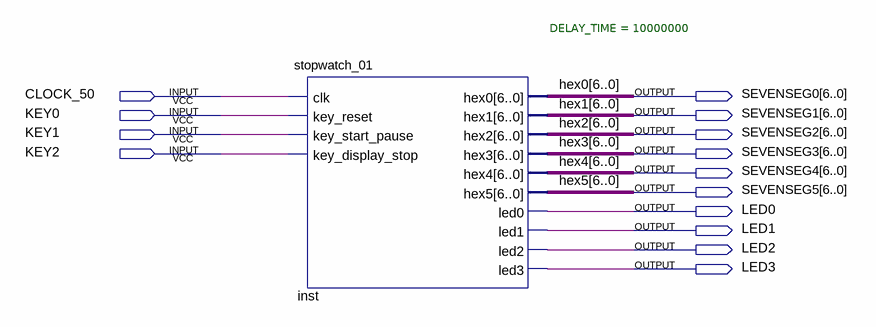
[diagram p0: schematic sheet]
// Quartus schematic stopwatch.bdf as structural Verilog: 1 symbols, 14 pins
module stopwatch (
  input  CLOCK_50,
  input  KEY0,
  input  KEY1,
  input  KEY2,
  output [6:0] SEVENSEG0,
  output [6:0] SEVENSEG1,
  output [6:0] SEVENSEG2,
  output [6:0] SEVENSEG3,
  output [6:0] SEVENSEG4,
  output [6:0] SEVENSEG5,
  output LED0,
  output LED1,
  output LED2,
  output LED3
);

  stopwatch_01 #(.DELAY_TIME(10000000)) inst (
    .clk(CLOCK_50), .key_reset(KEY0), .key_start_pause(KEY1), .key_display_stop(KEY2), .hex0(SEVENSEG0),
    .hex1(SEVENSEG1), .hex2(SEVENSEG2), .hex3(SEVENSEG3), .hex4(SEVENSEG4), .hex5(SEVENSEG5), .led0(LED0),
    .led1(LED1), .led2(LED2), .led3(LED3));

  // Other names for the same wires on the sheet: hex0[6:0] = SEVENSEG0; hex1[6:0] = SEVENSEG1; hex2[6:0] = SEVENSEG2;
  //   hex3[6:0] = SEVENSEG3; hex4[6:0] = SEVENSEG4; hex5[6:0] = SEVENSEG5
endmodule
